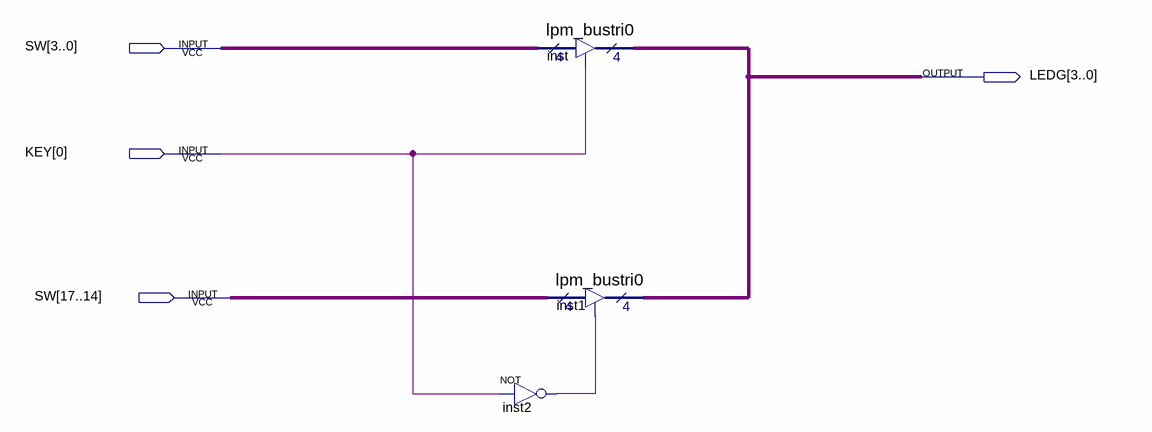
[diagram p0: schematic sheet]
// Quartus schematic tristate.bdf as structural Verilog: 3 symbols, 4 pins
module tristate (
  input  [17:0] SW,
  input  [0:0] KEY,
  output [3:0] LEDG
);

  wire inst2_out;

  lpm_bustri0 inst (.enabledt(KEY[0]), .data(SW[3:0]), .tridata(LEDG));
  not inst2 (inst2_out, KEY[0]);
  lpm_bustri0 inst1 (.enabledt(inst2_out), .data(SW[17:14]), .tridata(LEDG));
endmodule
